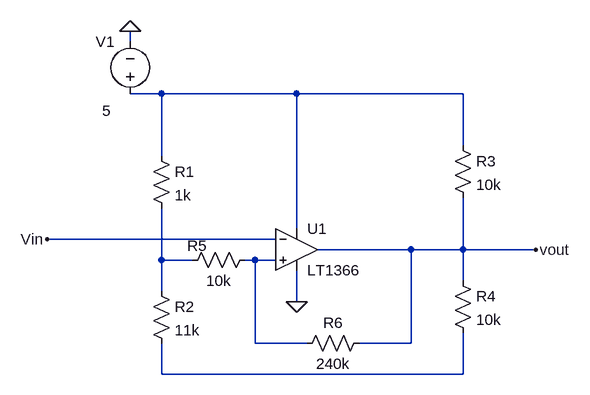
[diagram p0: schematic schmitt trigger.asc]
schmitt trigger.asc, the LTspice schematic file:
Version 4.1
SHEET 1 880 680
WIRE -128 -144 -128 -160
WIRE -80 -64 -128 -64
WIRE 128 -64 -80 -64
WIRE 384 -64 128 -64
WIRE 384 16 384 -64
WIRE -80 32 -80 -64
WIRE 128 144 128 -64
WIRE 96 160 -256 160
WIRE 304 176 160 176
WIRE 384 176 384 96
WIRE 384 176 304 176
WIRE 496 176 384 176
WIRE -80 192 -80 112
WIRE -32 192 -80 192
WIRE 64 192 48 192
WIRE 96 192 64 192
WIRE 384 224 384 176
WIRE -80 240 -80 192
WIRE 128 256 128 208
WIRE 64 320 64 192
WIRE 144 320 64 320
WIRE 304 320 304 176
WIRE 304 320 224 320
WIRE -80 368 -80 320
WIRE 384 368 384 304
WIRE 384 368 -80 368
FLAG 128 256 0
FLAG -128 -160 0
FLAG 496 176 vout
FLAG -256 160 Vin
SYMBOL res -96 16 R0
SYMATTR InstName R1
SYMATTR Value 1k
SYMBOL res -96 224 R0
SYMATTR InstName R2
SYMATTR Value 11k
SYMBOL voltage -128 -48 R180
WINDOW 0 24 96 Left 2
WINDOW 3 30 -10 Left 2
WINDOW 123 0 0 Left 0
WINDOW 39 0 0 Left 0
SYMATTR InstName V1
SYMATTR Value 5
SYMBOL res 368 0 R0
SYMATTR InstName R3
SYMATTR Value 10k
SYMBOL res 368 208 R0
SYMATTR InstName R4
SYMATTR Value 10k
SYMBOL OpAmps\\LT1366 128 112 R0
SYMATTR InstName U1
SYMBOL res 64 176 R90
WINDOW 0 10 89 VBottom 2
WINDOW 3 32 56 VTop 2
SYMATTR InstName R5
SYMATTR Value 10k
SYMBOL res 240 304 R90
WINDOW 0 0 56 VBottom 2
WINDOW 3 32 56 VTop 2
SYMATTR InstName R6
SYMATTR Value 240k

The netlist it stands for:
* schmitt trigger.asc
R1 N001 N002 1k
R2 N002 N004 11k
V1 N001 0 5
R3 N001 vout 10k
R4 vout N004 10k
X§U1 N003 Vin N001 0 vout LT1366  ; pins In+ In- V+ V- OUT
R5 N003 N002 10k
R6 vout N003 240k
.lib LTC.lib
.backanno
.end